# EAGLE design MethaneFlux (EAGLE 9.6.2)
Assembly variants: v1.0

## Sheet 1 of 2: Board 1- Power Module, Arduino MRK NB 1500, Methane Sensors (2600 2602 2611)
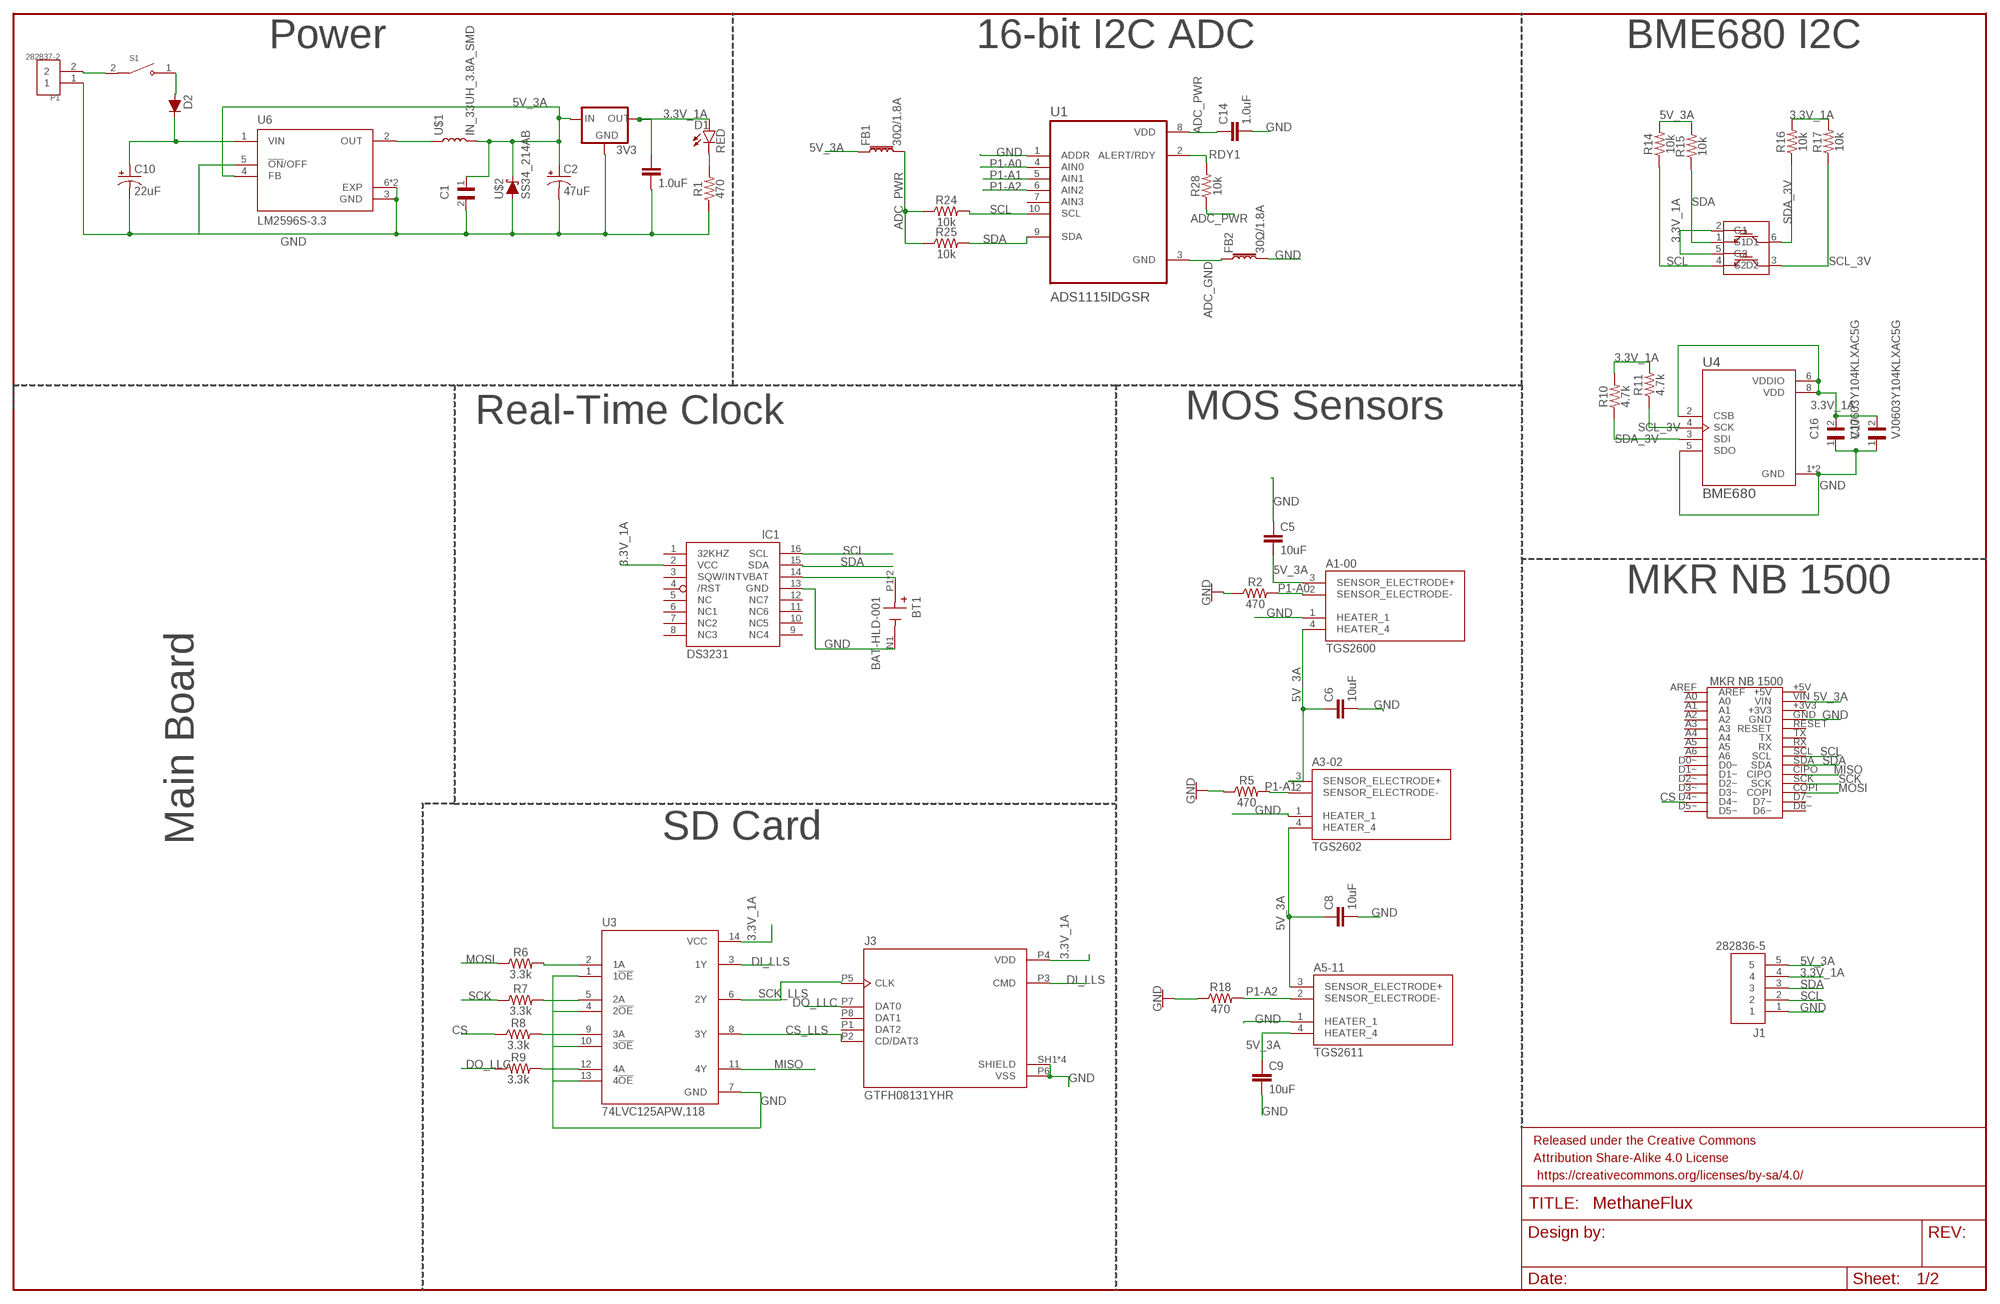
[diagram p0: schematic, sheet 1]

### Parts
3V3  V_REG_LD1117VXXLD1117-SMD  [SOT223]
A1-00  TGS2600  [TO255P920H830-4]
A3-02  TGS2602  [TGS2602]
A5-11  TGS2611  [TGS2611]
BT1  BAT-HLD-001  [BAT_BAT-HLD-001]
C1  T491A107M004AT  [CAPC3216X110N]
C2  47uF  47UF-POLAR-PANASONIC_D-35V-20%  [PANASONIC_D]
C3  1.0uF  1.0UF-0603-16V-10%  [0603]
C5  10uF  10UF-0603-6.3V-20%  [0603]
C6  10uF  10UF-0603-6.3V-20%  [0603]
C8  10uF  10UF-0603-6.3V-20%  [0603]
C9  10uF  10UF-0603-6.3V-20%  [0603]
C10  22uF  22UF-POLAR-PANASONIC_C-35V-20%  [PANASONIC_C]
C14  1.0uF  1.0UF-0603-16V-10%  [0603]
C16  VJ0603Y104KLXAC5G  [CAPC1608X92N]
C17  VJ0603Y104KLXAC5G  [CAPC1608X92N]
D1  RED  LED-RED0603  [LED-0603]
D2  200mA/100V/1V  DIODE-1N4148  [DIODE-1N4148]
FB1  30Ω/1.8A  FERRITE_BEAD-0603  [0603]
FB2  30Ω/1.8A  FERRITE_BEAD-0603  [0603]
FRAME1  FRAME-LEDGER  [CREATIVE_COMMONS]
IC1  DS3231/SO  [SO16W]
J1  282836-5  [TE_282836-5]
J3  GTFH08131YHR  [AMPHENOL_GTFH08131YHR]
P1  282837-2  [TE_282837-2]
R1  470  470OHM-0603-1/10W-1%  [0603]
R2  470  470OHM-0603-1/10W-1%  [0603]
R5  470  470OHM-0603-1/10W-1%  [0603]
R6  3.3k  3.3KOHM-0603-1/10W-1%  [0603]
R7  3.3k  3.3KOHM-0603-1/10W-1%  [0603]
R8  3.3k  3.3KOHM-0603-1/10W-1%  [0603]
R9  3.3k  3.3KOHM-0603-1/10W-1%  [0603]
R10  4.7k  4.7KOHM-0603-1/10W-1%  [0603]
R11  4.7k  4.7KOHM-0603-1/10W-1%  [0603]
R14  10k  10KOHM-0603-1/10W-1%  [0603]
R15  10k  10KOHM-0603-1/10W-1%  [0603]
R16  10k  10KOHM-0603-1/10W-1%  [0603]
R17  10k  10KOHM-0603-1/10W-1%  [0603]
R18  470  470OHM-0603-1/10W-1%  [0603]
R24  10k  10KOHM-0603-1/10W-1%  [0603]
R25  10k  10KOHM-0603-1/10W-1%  [0603]
R28  10k  10KOHM-0603-1/10W-1%  [0603]
S1  RB141C1100  [SW_RB141C1100]
U1  ADS1115IDGSR  [SOP50P490X110-10N]
U3  74LVC125APW,118  [IC_74LVC125APW,118]
U4  BME680  [PSON80P300X300X100-8N]
U6  LM2596S-3.3  [VREG_LM2596S-3.3]
U$1  IN_33UH_3.8A_SMD  [INDUCTOR_4X4MM]
U$2  SS34_214AB  [SOD-323]
U$3  2N7002DW  [SOT363]
U$5  MKRNB1500  [MRKNB1500]

### Nets
3.3V_1A [5$3v3_1A]: 3V3.2(OUT) C3.1 C16.2 C17.2 D1.A IC1.2(VCC) J1.4 J3.P4(VDD) R10.2 R11.2 R16.2 R17.2 U3.14(VCC) U4.2(CSB) U4.6(VDDIO) U4.8(VDD) U$3.2(G1) U$3.5(G2)
5V_3A [5$3v3_1A]: 3V3.3(IN) A1-00.3(SENSOR_ELECTRODE+) A1-00.4(HEATER_4) A3-02.3(SENSOR_ELECTRODE+) A3-02.4(HEATER_4) A5-11.3(SENSOR_ELECTRODE+) A5-11.4(HEATER_4) C1.1 C2.+ C5.2 C6.1 C8.1 C9.1 FB1.1 J1.5 R14.2 R15.2 U6.4(FB) U$1.P$2 U$2.C U$5.VIN
ADC_GND: FB2.1 U1.3(GND)
ADC_PWR: C14.1 FB1.2 R24.1 R25.1 R28.1 U1.8(VDD)
CS [SPI]: R8.1 U$5.D4~
CS_LLS [SPI]: J3.P2(CD/DAT3) U3.8(3Y)
DI_LLS [SPI]: J3.P3(CMD) U3.3(1Y)
DO_LLC [SPI]: J3.P7(DAT0) R9.1
GND [GND]: 3V3.1(GND) A1-00.1(HEATER_1) A3-02.1(HEATER_1) A5-11.1(HEATER_1) BT1.N1(-) C1.2 C2.- C3.2 C5.1 C6.2 C8.2 C9.2 C10.- C14.2 C16.1 C17.1 FB2.2 IC1.13(GND) J1.1 J3.P6(VSS) J3.SH1(SHIELD) J3.SH2(SHIELD) J3.SH3(SHIELD) J3.SH4(SHIELD) P1.1 R1.1 R2.1 R5.1 R18.1 U1.1(ADDR) U3.1(1!OE) U3.4(2!OE) U3.7(GND) U3.10(3!OE) U3.13(4!OE) U4.1(GND) U4.5(SDO) U4.7(GND) U6.3(GND) U6.5(!ON!/OFF) U6.6(EXP) U6.7(EXP) U$2.A U$5.GND
MISO [SPI]: U3.11(4Y) U$5.CIPO
MOSI [SPI]: R6.1 U$5.COPI
N$3 [SPI]: R6.2 U3.2(1A)
N$4: P1.2 S1.2
N$5: D2.A S1.1
N$6 [SPI]: R7.2 U3.5(2A)
N$7 [SPI]: R8.2 U3.9(3A)
N$8 [SPI]: R9.2 U3.12(4A)
N$9: U6.2(OUT) U$1.P$1
N$10: BT1.P1(+) BT1.P2(+) IC1.14(VBAT)
N$13: C10.+ D2.C U6.1(VIN)
N$14: D1.C R1.2
P1-A0 [ADC]: A1-00.2(SENSOR_ELECTRODE-) R2.2 U1.4(AIN0)
P1-A1 [ADC]: A3-02.2(SENSOR_ELECTRODE-) R5.2 U1.5(AIN1)
P1-A2 [ADC]: A5-11.2(SENSOR_ELECTRODE-) R18.2 U1.6(AIN2)
RDY1: R28.2 U1.2(ALERT/RDY)
SCK [SPI]: R7.1 U$5.SCK
SCK_LLS [SPI]: J3.P5(CLK) U3.6(2Y)
SCL: IC1.16(SCL) J1.2 R14.1 R24.2 U1.10(SCL) U$3.4(S2) U$5.SCL
SCL_3V: R11.1 R17.1 U4.4(SCK) U$3.3(D2)
SDA: IC1.15(SDA) J1.3 R15.1 R25.2 U1.9(SDA) U$3.1(S1) U$5.SDA
SDA_3V: R10.1 R16.1 U4.3(SDI) U$3.6(D1)
Unconnected: IC1.1(32KHZ) IC1.3(SQW/INT) IC1.4(/RST) IC1.5(NC) IC1.6(NC1) IC1.7(NC2) IC1.8(NC3) IC1.9(NC4) IC1.10(NC5) IC1.11(NC6) IC1.12(NC7) J3.P1(DAT2) J3.P8(DAT1) U1.7(AIN3) U$5.+3V3 U$5.+5V U$5.A0 U$5.A1 U$5.A2 U$5.A3 U$5.A4 U$5.A5 U$5.A6 U$5.AREF U$5.D0~ U$5.D1~ U$5.D2~ U$5.D3~ U$5.D5~ U$5.D6~ U$5.D7~ U$5.RESET U$5.RX U$5.TX

### Notes on the sheet
- Power | 16-bit I2C ADC | BME680 I2C
- Real-Time Clock | MOS Sensors
- MKR NB 1500
- Main Board | SD Card

## Sheet 2 of 2: Breakoff part to board 1- Methane Sensors (2600 2602 2611) and the ADC & BME
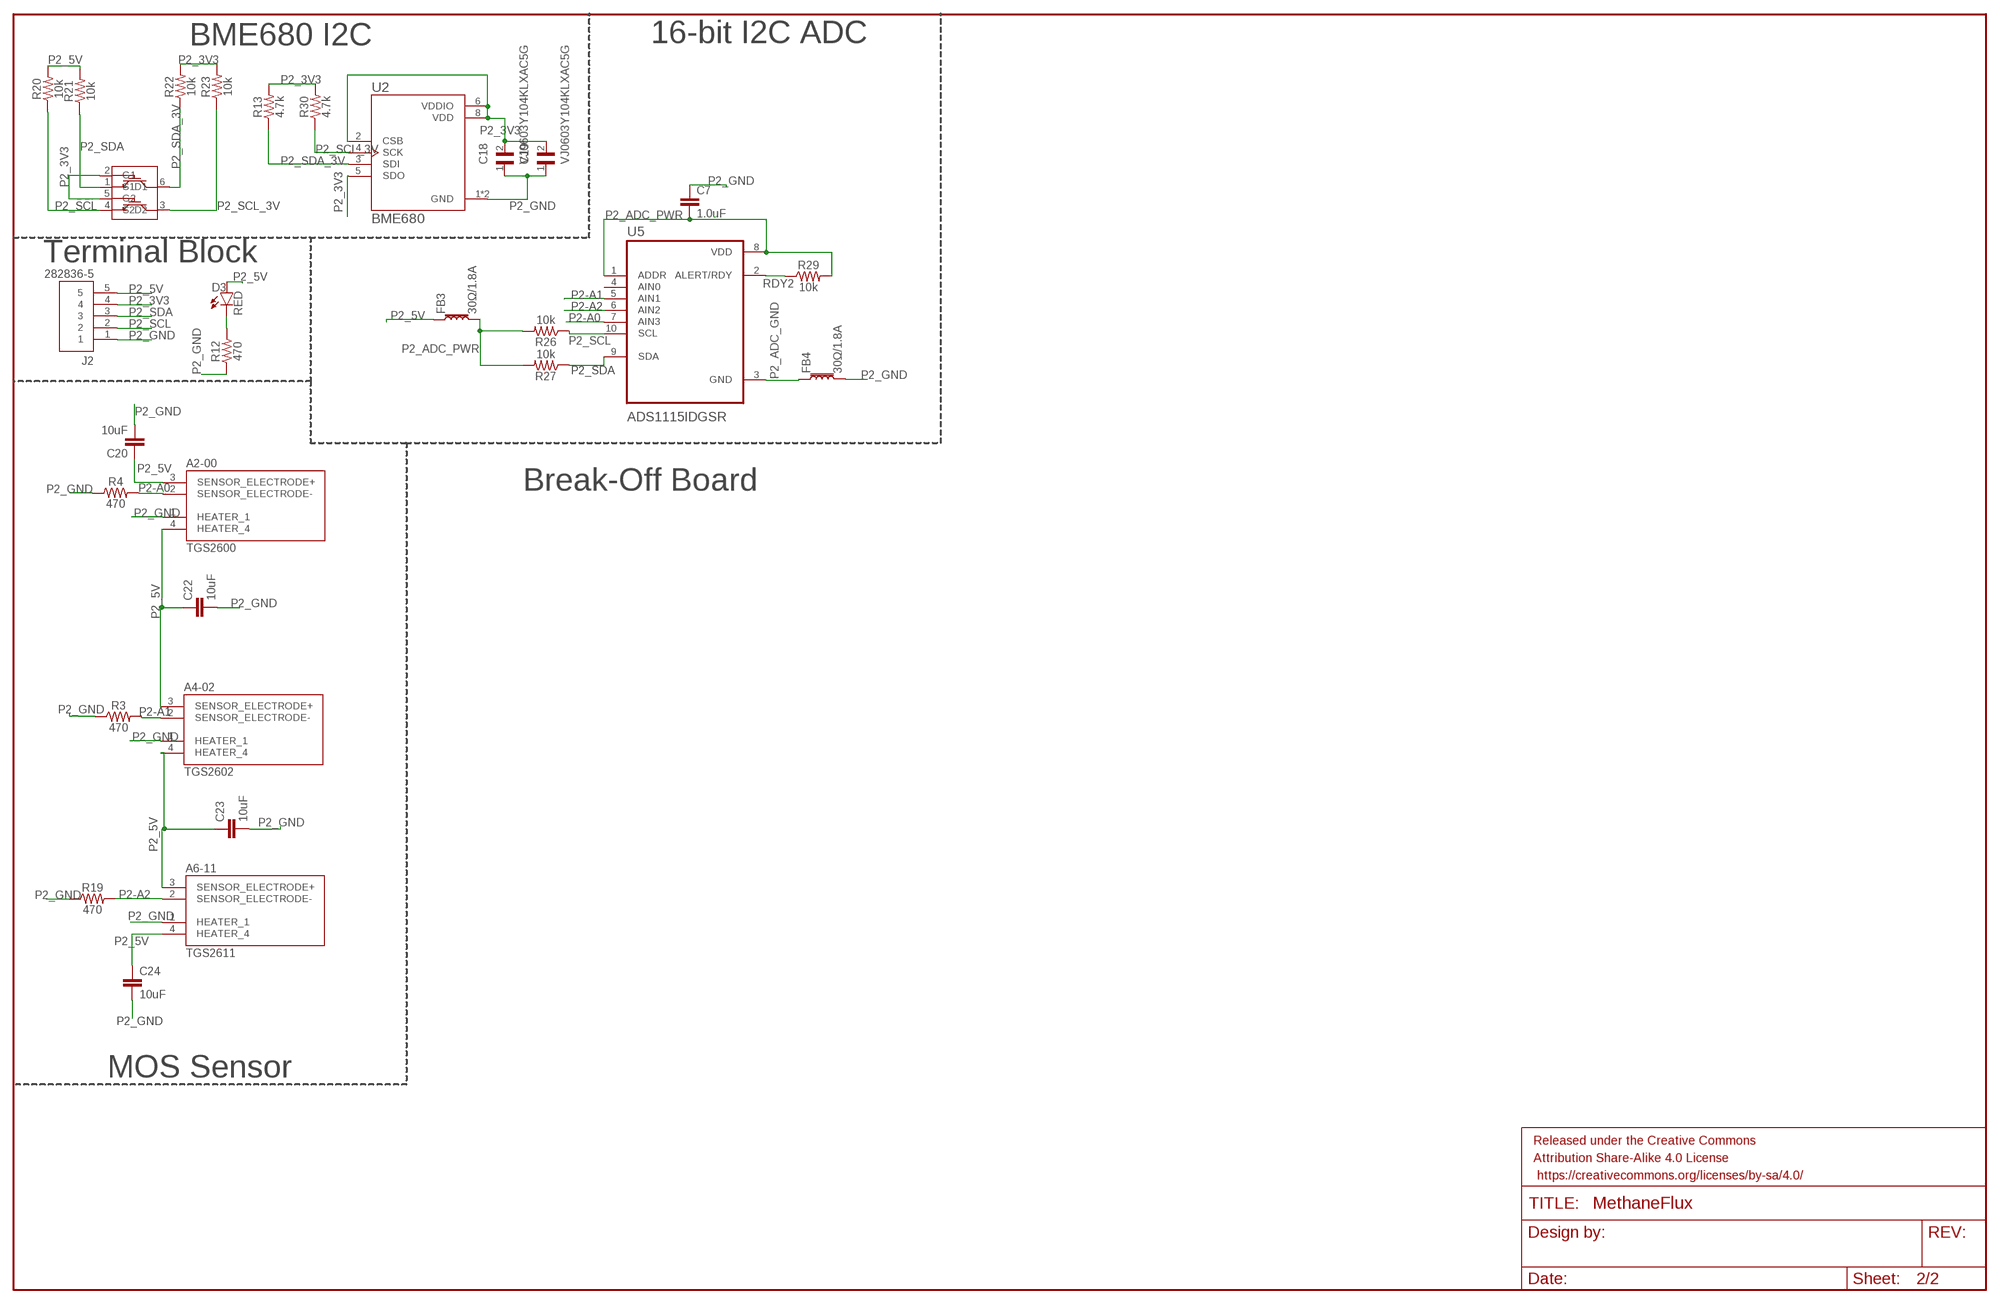
[diagram p1: schematic, sheet 2]

### Parts
A2-00  TGS2600  [TO255P920H830-4]
A4-02  TGS2602  [TGS2602]
A6-11  TGS2611  [TGS2611]
C7  1.0uF  1.0UF-0603-16V-10%  [0603]
C18  VJ0603Y104KLXAC5G  [CAPC1608X92N]
C19  VJ0603Y104KLXAC5G  [CAPC1608X92N]
C20  10uF  10UF-0603-6.3V-20%  [0603]
C22  10uF  10UF-0603-6.3V-20%  [0603]
C23  10uF  10UF-0603-6.3V-20%  [0603]
C24  10uF  10UF-0603-6.3V-20%  [0603]
D3  RED  LED-RED0603  [LED-0603]
FB3  30Ω/1.8A  FERRITE_BEAD-0603  [0603]
FB4  30Ω/1.8A  FERRITE_BEAD-0603  [0603]
FRAME2  FRAME-LEDGER  [CREATIVE_COMMONS]
J2  282836-5  [TE_282836-5]
R3  470  470OHM-0603-1/10W-1%  [0603]
R4  470  470OHM-0603-1/10W-1%  [0603]
R12  470  470OHM-0603-1/10W-1%  [0603]
R13  4.7k  4.7KOHM-0603-1/10W-1%  [0603]
R19  470  470OHM-0603-1/10W-1%  [0603]
R20  10k  10KOHM-0603-1/10W-1%  [0603]
R21  10k  10KOHM-0603-1/10W-1%  [0603]
R22  10k  10KOHM-0603-1/10W-1%  [0603]
R23  10k  10KOHM-0603-1/10W-1%  [0603]
R26  10k  10KOHM-0603-1/10W-1%  [0603]
R27  10k  10KOHM-0603-1/10W-1%  [0603]
R29  10k  10KOHM-0603-1/10W-1%  [0603]
R30  4.7k  4.7KOHM-0603-1/10W-1%  [0603]
U2  BME680  [PSON80P300X300X100-8N]
U5  ADS1115IDGSR  [SOP50P490X110-10N]
U$4  2N7002DW  [SOT363]

### Nets
N$1 [5$3v3_1A]: D3.C R12.2
P2-A0 [ADC]: A2-00.2(SENSOR_ELECTRODE-) R4.2 U5.7(AIN3)
P2-A1 [ADC]: A4-02.2(SENSOR_ELECTRODE-) R3.2 U5.5(AIN1)
P2-A2 [ADC]: A6-11.2(SENSOR_ELECTRODE-) R19.2 U5.6(AIN2)
P2_3V3 [5$3v3_1A]: C18.2 C19.2 J2.4 R13.2 R22.2 R23.2 R30.2 U2.2(CSB) U2.5(SDO) U2.6(VDDIO) U2.8(VDD) U$4.2(G1) U$4.5(G2)
P2_5V [5$3v3_1A]: A2-00.3(SENSOR_ELECTRODE+) A2-00.4(HEATER_4) A4-02.3(SENSOR_ELECTRODE+) A4-02.4(HEATER_4) A6-11.3(SENSOR_ELECTRODE+) A6-11.4(HEATER_4) C20.1 C22.1 C23.1 C24.1 D3.A FB3.1 J2.5 R20.2 R21.2
P2_ADC_GND: FB4.1 U5.3(GND)
P2_ADC_PWR: C7.2 FB3.2 R26.2 R27.2 R29.2 U5.1(ADDR) U5.8(VDD)
P2_GND [P2_GND]: A2-00.1(HEATER_1) A4-02.1(HEATER_1) A6-11.1(HEATER_1) C7.1 C18.1 C19.1 C20.2 C22.2 C23.2 C24.2 FB4.2 J2.1 R3.1 R4.1 R12.1 R19.1 U2.1(GND) U2.7(GND)
P2_SCL: J2.2 R20.1 R26.1 U5.10(SCL) U$4.4(S2)
P2_SCL_3V: R23.1 R30.1 U2.4(SCK) U$4.3(D2)
P2_SDA: J2.3 R21.1 R27.1 U5.9(SDA) U$4.1(S1)
P2_SDA_3V: R13.1 R22.1 U2.3(SDI) U$4.6(D1)
RDY2: R29.1 U5.2(ALERT/RDY)
Unconnected: U5.4(AIN0)

### Notes on the sheet
- BME680 I2C | 16-bit I2C ADC
- Terminal Block
- Break-Off Board
- MOS Sensor

## Library data of the parts
3V3 = SparkFun-IC-Power:V_REG_LD1117VXX: LD1117VXX voltage regulator. We carry the 3.3V version (COM-00526) in TO-220 package.; PROD_ID: VREG-13917
A1-00 A2-00 = TGS2600:TGS2600: Check availability <https://pricing.snapeda.com/parts/TGS2600/Figaro/view-part?ref=eda>; AVAILABILITY: In Stock; CHECK_PRICES: https://www.snapeda.com/parts/TGS2600/Figaro/view-part/?ref=eda; DESCRIPTION: Gas sensor [Figaro] TGS2600 Gas sensor; MF: Figaro; MP: TGS2600; PACKAGE: None; PRICE: None; SNAPEDA_LINK: https://www.snapeda.com/parts/TGS2600/Figaro/view-part/?ref=snap
A3-02 A4-02 = TGS2600:TGS2602
A5-11 A6-11 = TGS2600:TGS2611
BT1 = BAT-HLD-001:BAT-HLD-001: Battery Retainer Coin, 20.0mm 1 Cell SMD (SMT) Tab Check availability <https://pricing.snapeda.com/parts/BAT-HLD-001/Linx%20Technologies/view-part?ref=eda>; AVAILABILITY: In Stock; CHECK_PRICES: https://www.snapeda.com/parts/BAT-HLD-001/Linx+Technologies+Inc./view-part/?ref=eda; DESCRIPTION: Holder for CR2032 and CR2025 Batteries, Surface-Mount, Bulk Packaging; MF: Linx Technologies; MP: BAT-HLD-001; PACKAGE: None; PRICE: None; PURCHASE-URL: https://www.snapeda.com/api/url_track_click_mouser/?unipart_id=184402&manufacturer=Linx Technologies&part_name=BAT-HLD-001&search_term=cr2032 battery holder; SNAPEDA_LINK: https://www.snapeda.com/parts/BAT-HLD-001/Linx+Technologies+Inc./view-part/?ref=snap
C1 = T491A107M004AT:T491A107M004AT: Tantalum Capacitor; Capacitor Type:Solid; Capacitance:100µF; Capacitance Tolerance:± 20%; Voltage Rating:4VDC; Capacitor Dielectric Type:Tantalum; Package/Case:3216-18; Termination Type:SMD; ESR:4ohm; Leaded Process Compatible:Yes ;RoHS Compliant: Yes Check availability <https://pricing.snapeda.com/parts/T491A107M004AT/KEMET/view-part?ref=eda>; AVAILABILITY: In Stock; CHECK_PRICES: https://www.snapeda.com/parts/T491A107M004AT/KEMET/view-part/?ref=eda; DESCRIPTION: Capacitors Tantalum PCB 100uF SMD Tol 20% 4 VDC Case Size 3216 T491 Series | KEMET T491A107M004AT; MF: KEMET; MP: T491A107M004AT; PACKAGE: SMD-2 KEMET; PRICE: None; PURCHASE-URL: https://www.snapeda.com/api/url_track_click_mouser/?unipart_id=577514&manufacturer=KEMET&part_name=T491A107M004AT&search_term=t491a107m004at; SNAPEDA_LINK: https://www.snapeda.com/parts/T491A107M004AT/KEMET/view-part/?ref=snap
C2 = SparkFun-Capacitors:47UF-POLAR: 47µF polarized capacitors A capacitor is a passive two-terminal electrical component used to store electrical energy temporarily in an electric field.; PROD_ID: CAP-08478
C3 C7 C14 = SparkFun-Capacitors:1.0UF: 1µF ceramic capacitors A capacitor is a passive two-terminal electrical component used to store electrical energy temporarily in an electric field.; PROD_ID: CAP-00868
C5 C6 C8 C9 C20 C22-C24 = SparkFun-Capacitors:10UF: 10.0µF ceramic capacitors A capacitor is a passive two-terminal electrical component used to store electrical energy temporarily in an electric field.; PROD_ID: CAP-11015
C10 = SparkFun-Capacitors:22UF-POLAR: 22µF polarized capacitors A capacitor is a passive two-terminal electrical component used to store electrical energy temporarily in an electric field.; PROD_ID: CAP-08618
C16-C19 = VJ0603Y104KLXAC5G:VJ0603Y104KLXAC5G: Multilayer Ceramic Capacitors MLCC - SMD/SMT 100nF 25volts 10% Check availability <https://pricing.snapeda.com/parts/VJ0603Y104KLXAC5G/Vishay/view-part?ref=eda>; AVAILABILITY: In Stock; CHECK_PRICES: https://www.snapeda.com/parts/VJ0603Y104KLXAC5G/Vishay/view-part/?ref=eda; DESCRIPTION: Multilayer Ceramic Capacitors MLCC - SMD/SMT 100nF 25volts 10%; MF: Vishay; MP: VJ0603Y104KLXAC5G; PACKAGE: 0603 Vishay; PRICE: None; SNAPEDA_LINK: https://www.snapeda.com/parts/VJ0603Y104KLXAC5G/Vishay/view-part/?ref=snap
D1 D3 = SparkFun-LED:LED-RED: Red SMD LED Used in manufacturing of most products at SparkFun Packages: 0603 - SMD 0603 package [Product Link] <http://docs.avagotech.com/docs/AV02-0551EN> 0603 SMART - SMD 0603 SMART package ( more efficient and expensive)[Product Link] <http://www.osram-os.com/Graphics/XPic2/00077099_0.pdf> 1206 - SMD1206 package [Product Link] <https://www.sparkfun.com/datasheets/DevTools/LilyPad/Q150OVS4.pdff> SparkFun Products: Pro Mini 328 -5V <https://www.sparkfun.com/products/821> RedBoard <https://www.sparkfun.com/products/12757> IOIO-OTG <https://www.sparkfun.com/products/13613>; PROD_ID: DIO-00819
D2 = SparkFun-DiscreteSemi:DIODE: Diode These are standard reverse protection diodes and small signal diodes. SparkFun Products: SparkFun SparkPunk Sound Kit <https://www.sparkfun.com/products/11177> SparkFun ESP8266 Thing <https://www.sparkfun.com/products/13231>; PROD_ID: DIO-08378
FB1-FB4 = SparkFun-Coils:FERRITE_BEAD: Ferrite Bead (blocks, cores, rings, chokes, etc.) Inductor with layers of ferrite used to suppress high frequencies. Often used to isolate high frequency noise. SparkFun Products: IOIO-OTG - V2.2 <https://www.sparkfun.com/products/13613> SparkFun SAMD21 Mini Breakout <https://www.sparkfun.com/products/13664> SparkFun 6 Degrees of Freedom Breakout - LSM6DS3 <https://www.sparkfun.com/products/13339> SparkFun SAMD21 Dev Breakout <https://www.sparkfun.com/products/13672>; PROD_ID: NDUC-13805
FRAME1 FRAME2 = SparkFun-Aesthetics:FRAME-LEDGER: Schematic Frame - Ledger Standard 11x14 US Ledger frame
IC1 = DS3231:DS3231: Check availability <https://pricing.snapeda.com/parts/DS3231/Analog%20Devices/view-part?ref=eda>; AVAILABILITY: In Stock; CHECK_PRICES: https://www.snapeda.com/parts/DS3231/Analog+Devices/view-part/?ref=eda; DESCRIPTION: Real Time Clock (RTC) IC Clock/Calendar - I²C, 2-Wire Serial 8-SOIC (0.154, 3.90mm Width); MF: Analog Devices; MP: DS3231; PACKAGE: SOIC-16 Maxim Integrated; PRICE: None; PURCHASE-URL: https://www.snapeda.com/api/url_track_click_mouser/?unipart_id=553791&manufacturer=Analog Devices&part_name=DS3231&search_term=ds3231; SNAPEDA_LINK: https://www.snapeda.com/parts/DS3231/Analog+Devices/view-part/?ref=snap
J1 J2 = 282836-5:282836-5: Check availability <https://pricing.snapeda.com/parts/282836-5/TE%20Connectivity/view-part?ref=eda>; AVAILABILITY: In Stock; CHECK_PRICES: https://www.snapeda.com/parts/282836-5/TE+Connectivity+AMP+Connectors/view-part/?ref=eda; COMMENT: 282836-5; DESCRIPTION: 5 Position Wire to Board Terminal Block Horizontal with Board 0.197 (5.00mm) Through Hole; EU_ROHS_COMPLIANCE: Compliant with Exemptions; MF: TE Connectivity; MP: 282836-5; PACKAGE: None; PRICE: None; PURCHASE-URL: https://www.snapeda.com/api/url_track_click_mouser/?unipart_id=417471&manufacturer=TE Connectivity&part_name=282836-5&search_term=282836-5; SNAPEDA_LINK: https://www.snapeda.com/parts/282836-5/TE+Connectivity+AMP+Connectors/view-part/?ref=snap
J3 = GTFH08131YHR:GTFH08131YHR: Check availability <https://pricing.snapeda.com/parts/GTFH08131YHR/Amphenol%20ICC/view-part?ref=eda>; AVAILABILITY: In Stock; CHECK_PRICES: https://www.snapeda.com/parts/GTFH08131YHR/Amphenol+FCI/view-part/?ref=eda; DESCRIPTION: Micro SD and SD Card Sockets, Input Output Connectors, Micro SD Socket, 8 Position, Hinge Type Right Angle SMT, LCP Black; MF: Amphenol ICC; MP: GTFH08131YHR; PACKAGE: None; PRICE: None; PURCHASE-URL: https://www.snapeda.com/api/url_track_click_mouser/?unipart_id=3603870&manufacturer=Amphenol ICC&part_name=GTFH08131YHR&search_term=micro sd socket; SNAPEDA_LINK: https://www.snapeda.com/parts/GTFH08131YHR/Amphenol+FCI/view-part/?ref=snap
P1 = 282837-2:282837-2: TERM BLOCK 5.08MM 2POS SIDE ENTY Check availability <https://pricing.snapeda.com/parts/282837-2/TE%20Connectivity/view-part?ref=eda>; AVAILABILITY: In Stock; CHECK_PRICES: https://www.snapeda.com/parts/282837-2/TE+Connectivity+AMP+Connectors/view-part/?ref=eda; COMMENT: 282837-2; DESCRIPTION: Terminal Block Connector Wire Receptacle 2 5.08 mm 30-16 AWG Green 13.5 A 250 V | TE Connectivity 282837-2; MF: TE Connectivity; MP: 282837-2; PACKAGE: None; PRICE: None; PURCHASE-URL: https://www.snapeda.com/api/url_track_click_mouser/?unipart_id=2549980&manufacturer=TE Connectivity&part_name=282837-2&search_term=None; SNAPEDA_LINK: https://www.snapeda.com/parts/282837-2/TE+Connectivity+AMP+Connectors/view-part/?ref=snap
R1-R5 R12 R18 R19 = SparkFun-Resistors:470OHM: 470Ω resistor A resistor is a passive two-terminal electrical component that implements electrical resistance as a circuit element. Resistors act to reduce current flow, and, at the same time, act to lower voltage levels within circuits. - Wikipedia; PROD_ID: RES-07869
R6-R9 = SparkFun-Resistors:3.3KOHM: 3.3kΩ resistor A resistor is a passive two-terminal electrical component that implements electrical resistance as a circuit element. Resistors act to reduce current flow, and, at the same time, act to lower voltage levels within circuits. - Wikipedia; PROD_ID: RES-07851
R10 R11 R13 R30 = SparkFun-Resistors:4.7KOHM: 4.7kΩ resistor A resistor is a passive two-terminal electrical component that implements electrical resistance as a circuit element. Resistors act to reduce current flow, and, at the same time, act to lower voltage levels within circuits. - Wikipedia; PROD_ID: RES-07857
R14-R17 R20-R29 = SparkFun-Resistors:10KOHM: 10kΩ resistor A resistor is a passive two-terminal electrical component that implements electrical resistance as a circuit element. Resistors act to reduce current flow, and, at the same time, act to lower voltage levels within circuits. - Wikipedia; PROD_ID: RES-00824
S1 = RB141C1100:RB141C1100: Swicth SPST RB141C1100 Check availability <https://pricing.snapeda.com/parts/RB141C1100/E-Switch/view-part?ref=eda>; AVAILABILITY: In Stock; CHECK_PRICES: https://www.snapeda.com/parts/RB141C1100/E-Switch/view-part/?ref=eda; DESCRIPTION: Rocker Switch, RB1 Series, SPST, ON-OFF, Non-Illum, Black, 15A, 125VAC, QC | E-Switch RB141C1100; MF: E-Switch; MP: RB141C1100; PACKAGE: None; PRICE: None; PURCHASE-URL: https://www.snapeda.com/api/url_track_click_mouser/?unipart_id=4449618&manufacturer=E-Switch&part_name=RB141C1100&search_term=rs-001g-a-bb-4; SNAPEDA_LINK: https://www.snapeda.com/parts/RB141C1100/E-Switch/view-part/?ref=snap
U1 U5 = ADS1115IDGSR:ADS1115IDGSR: Check availability <https://pricing.snapeda.com/parts/ADS1115IDGSR/Texas%20Instruments/view-part?ref=eda>; AVAILABILITY: In Stock; CHECK_PRICES: https://www.snapeda.com/parts/ADS1115IDGSR/Texas+Instruments/view-part/?ref=eda; DESCRIPTION: 16-bit, 860-SPS, 4-channel, delta-sigma ADC with PGA, oscillator, VREF, comparator and I2C; MF: Texas Instruments; MP: ADS1115IDGSR; PACKAGE: VSSOP-10 Texas Instruments; PRICE: None; PURCHASE-URL: https://www.snapeda.com/api/url_track_click_mouser/?unipart_id=45903&manufacturer=Texas Instruments&part_name=ADS1115IDGSR&search_term=ads1115idgsr; SNAPEDA_LINK: https://www.snapeda.com/parts/ADS1115IDGSR/Texas+Instruments/view-part/?ref=snap
U2 U4 = BME680:BME680: Integrated Environmental Unit Check availability <https://pricing.snapeda.com/parts/BME680/Bosch%20Sensortec/view-part?ref=eda>; AVAILABILITY: In Stock; CHECK_PRICES: https://www.snapeda.com/parts/BME680/Bosch+Sensortec/view-part/?ref=eda; DESCRIPTION: Gas, Humidity, Pressure, Temperature Sensor I²C, SPI Output; MF: Bosch Sensortec; MP: BME680; PACKAGE: LGA-8 Bosch Tools; PRICE: None; PURCHASE-URL: https://www.snapeda.com/api/url_track_click_mouser/?unipart_id=947201&manufacturer=Bosch Sensortec&part_name=BME680&search_term=bme680; SNAPEDA_LINK: https://www.snapeda.com/parts/BME680/Bosch+Sensortec/view-part/?ref=snap
U3 = 74LVC125APW_118:74LVC125APW,118: Check availability <https://pricing.snapeda.com/parts/74LVC125APW%2C118/Nexperia%20USA%20Inc./view-part?ref=eda> Check availability <https://pricing.snapeda.com/parts/74LVC125APW%2C118/Nexperia%20USA%20Inc./view-part?ref=eda> Check availability <https://pricing.snapeda.com/parts/74LVC125APW%2C118/Nexperia%20USA%20Inc./view-part?ref=eda>; AVAILABILITY: In Stock; CHECK_PRICES: https://www.snapeda.com/parts/74LVC125APW,118/Nexperia/view-part/?ref=eda; DESCRIPTION: Buffer, Non-Inverting 4 Element 1 Bit per Element 3-State Output 14-TSSOP; MF: Nexperia USA Inc.; MP: 74LVC125APW,118; PACKAGE: TSSOP14-14 Nexperia USA Inc.; PRICE: None; PURCHASE-URL: https://www.snapeda.com/api/url_track_click_mouser/?unipart_id=5248541&manufacturer=Nexperia USA Inc.&part_name=74LVC125APW,118&search_term=74lvc125apw; SNAPEDA_LINK: https://www.snapeda.com/parts/74LVC125APW,118/Nexperia/view-part/?ref=snap
U6 = LM2596S-3.3:LM2596S-3.3: Conv DC-DC 4.5V to 40V Inv/Step Down Single-Out 3.3V 3A 6-Pin(5+Tab) TO-263 Tube Check availability <https://pricing.snapeda.com/parts/LM2596S-3.3/Texas%20Instruments/view-part?ref=eda>; AVAILABILITY: In Stock; DESCRIPTION: SIMPLE SWITCHER&reg; 4.5V to 40V, 3A Low Component Count Step-Down Regulator 5-DDPAK/TO-263; MF: Texas Instruments; MP: LM2596S-3.3; PACKAGE: TO-263-5 Texas Instruments; PRICE: None; PURCHASE-URL: https://pricing.snapeda.com/search/part/LM2596S-3.3/?ref=eda
U$1 = SV_Inductors:IN_33UH_3.8A_SMD
U$2 = SV_Diode:SS34_214AB
U$3 U$4 = 2N7002DW:2N7002DW: Check availability <https://pricing.snapeda.com/parts/2N7002DW/onsemi/view-part?ref=eda>; AVAILABILITY: In Stock; CHECK_PRICES: https://www.snapeda.com/parts/2N7002DW/Onsemi/view-part/?ref=eda; DESCRIPTION: Mosfet Array 60V 115mA 200mW Surface Mount SC-88 (SC-70-6); MF: onsemi; MP: 2N7002DW; PACKAGE: SC-88-6 ON Semiconductor; PRICE: None; PURCHASE-URL: https://www.snapeda.com/api/url_track_click_mouser/?unipart_id=7265289&manufacturer=onsemi&part_name=2N7002DW&search_term=2n7002dw; SNAPEDA_LINK: https://www.snapeda.com/parts/2N7002DW/Onsemi/view-part/?ref=snap
U$5 = MKRNB1500:MKRNB1500: Double check before printing that this layout is right.

## Net classes
0 I2C: width 0.229 mm, clearance 0.003 mm
1 ADC: width 0.305 mm, clearance 0.1 mm
2 PowerIn: width 0.508 mm, clearance 0.003 mm
3 5$3v3_1A: width 0.076 mm, clearance 0.003 mm
5 GND: width 0.025 mm, clearance 0.003 mm
6 P2_GND: width 0.025 mm, clearance 0.003 mm

## Board
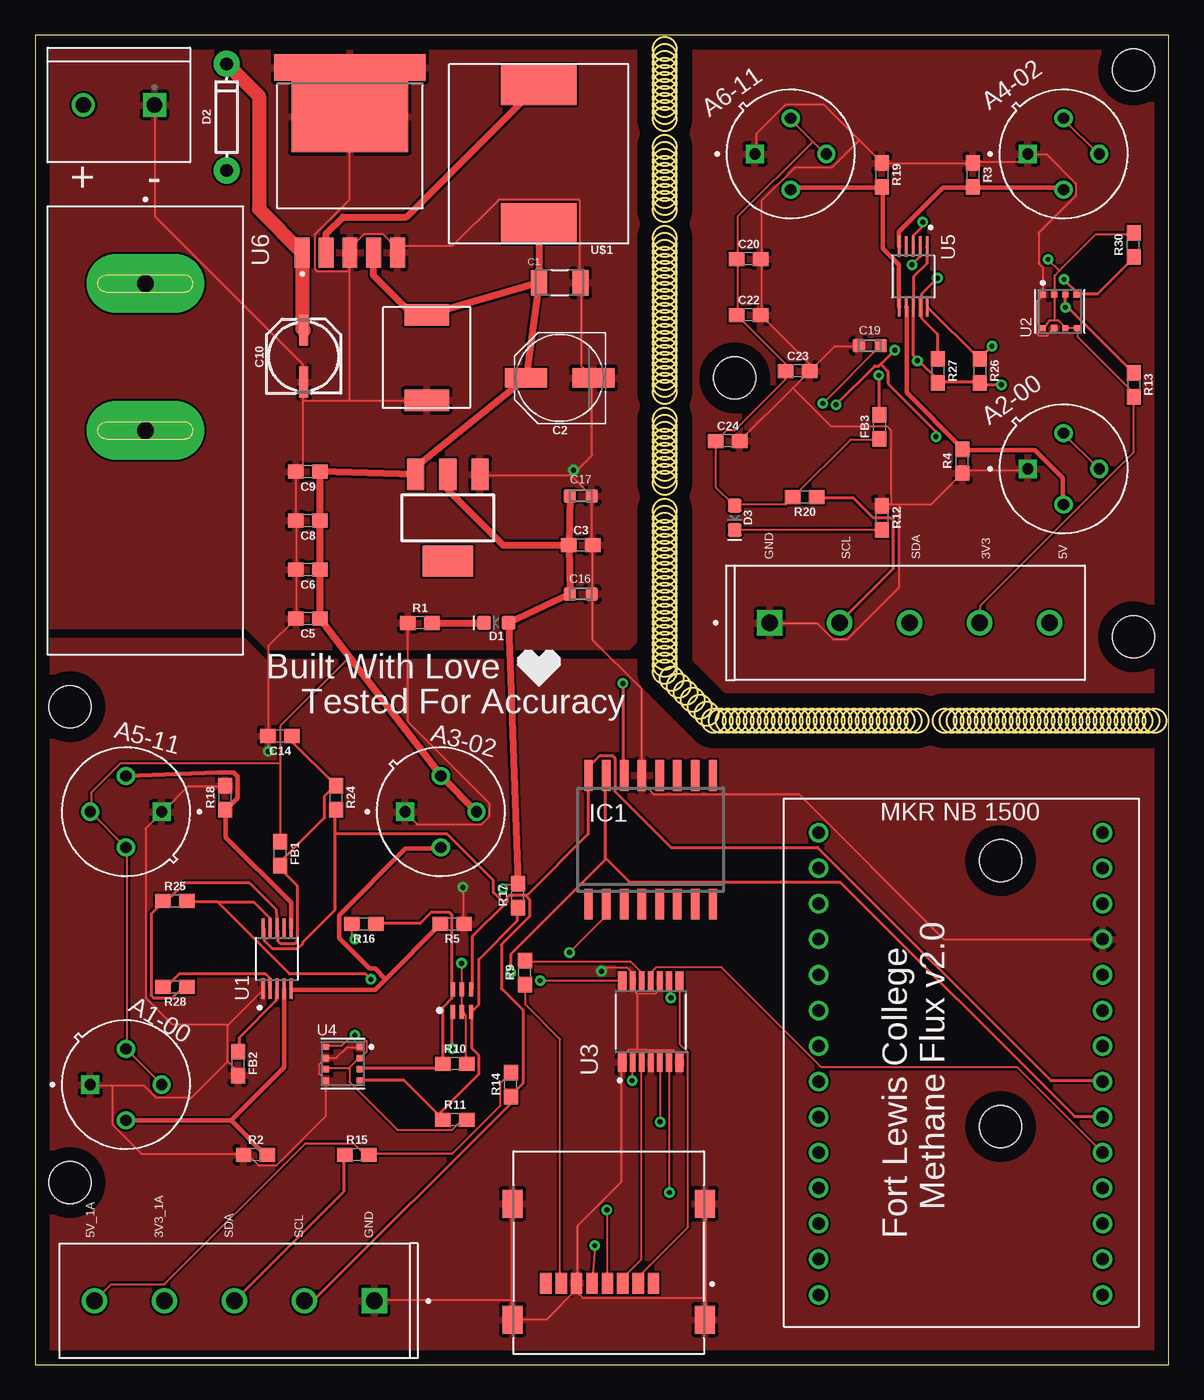
[diagram p2: board, top side]
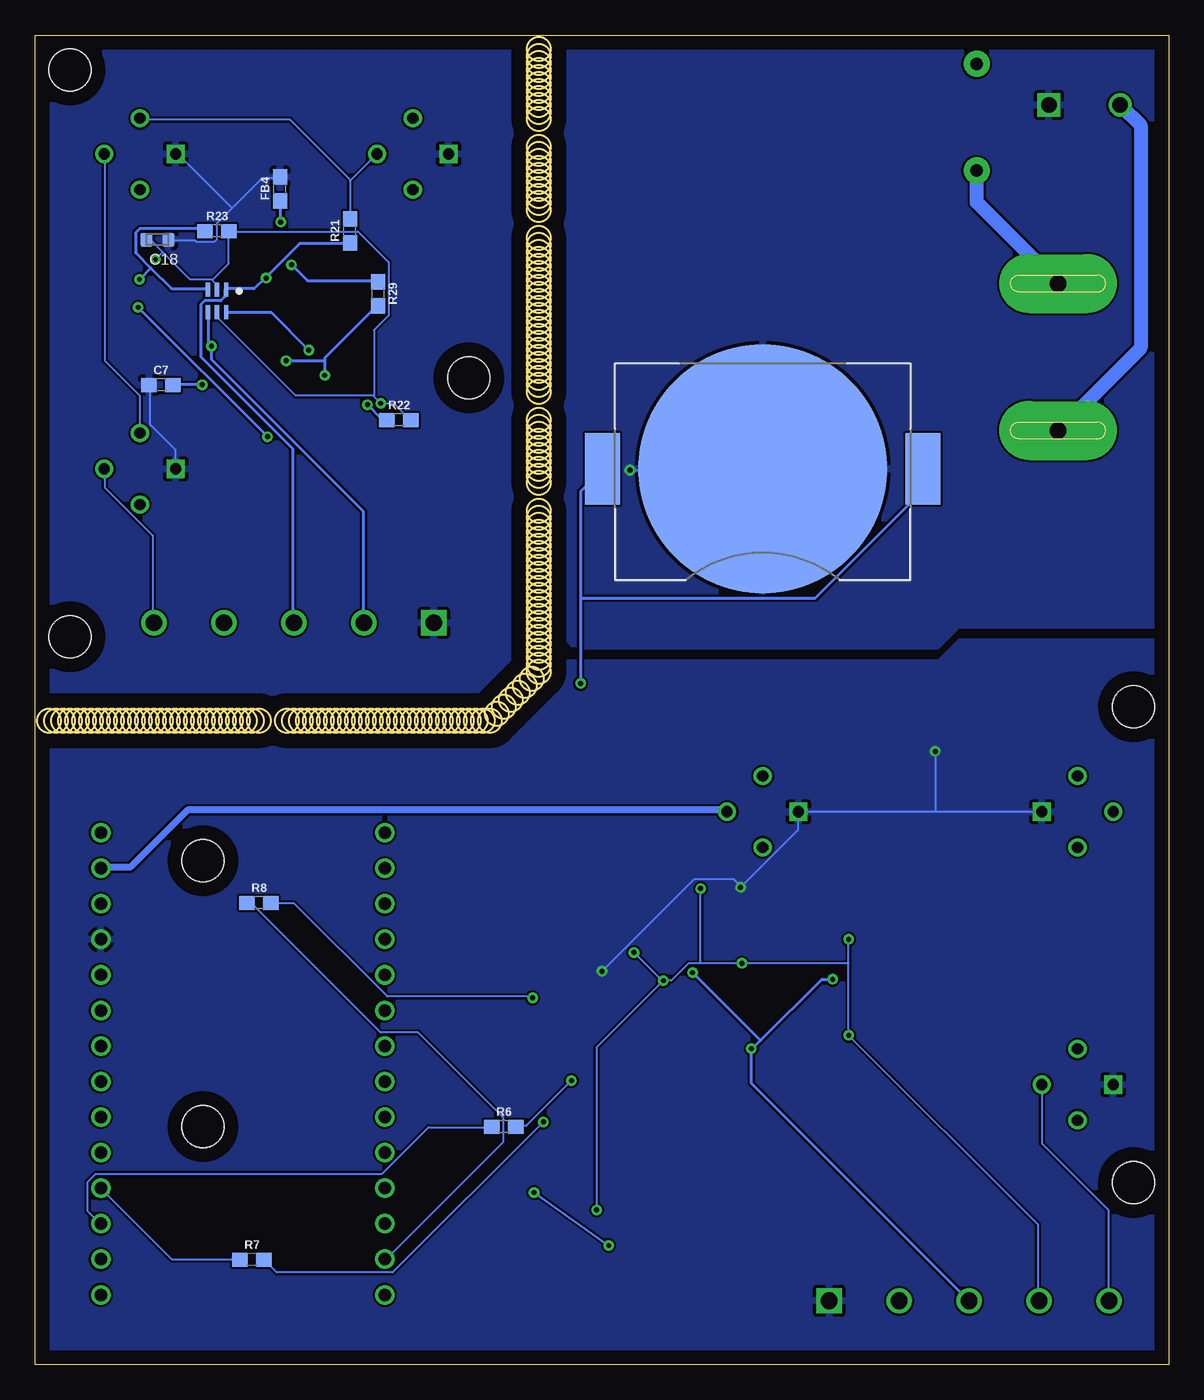
[diagram p3: board, bottom side, seen from below]

Size 81 x 95 mm. Coordinates in mm from the lower left corner, seen from the top.
Outline: 0,0 81,0 81,95 0,95 0,0
Outline: circle at 45,93.5 radius 0.85
Outline: circle at 45,93 radius 0.85
Outline: circle at 45,92.5 radius 0.85
Outline: circle at 45,92 radius 0.85
Outline: circle at 45,91.5 radius 0.85
Outline: circle at 45,91 radius 0.85
Outline: circle at 45,90.5 radius 0.85
Outline: circle at 45,90 radius 0.85
Outline: circle at 45,89.5 radius 0.85
Outline: circle at 45,87 radius 0.85
Outline: circle at 45,86.5 radius 0.85
Outline: circle at 45,86 radius 0.85
Outline: circle at 45,85.5 radius 0.85
Outline: circle at 45,85 radius 0.85
Outline: circle at 45,84.5 radius 0.85
Outline: circle at 45,84 radius 0.85
Outline: circle at 45,83.5 radius 0.85
Outline: circle at 45,83 radius 0.85
Outline: circle at 45,80.5 radius 0.85
Outline: circle at 45,80 radius 0.85
Copper layers (1*16): Top 0.035mm / dielectric 1.5mm / Bottom 0.035mm
Design rules "default *": minimum track width 6mil, minimum drill 0.35mm, track to track 6mil, track to pad 6mil, pad to pad 6mil, via to via 6mil, smd to smd 6mil, copper to edge 40mil, drill to drill 6mil, minimum pad ring 10mil, minimum via ring 8mil, stop-mask expansion 4mil, vias tented up to drill 0mil, thermal gap 10mil
Holes 3 mm at 78.5,52 50,70.5 78.5,92.5 2.5,13 2.5,47 69,36 69,17

### Footprints (pad centres in the part's own frame; a part is rotated, then mirrored left to right if it is on the bottom)
SOT223 = smd 1.219 x 2.235: 1 -2.311,-3.099; 2 0,-3.099; 3 2.311,-3.099 | smd 3.6 x 2.2: 4 0,3.099
TO255P920H830-4 = drill 0.8 square: 1 -2.55,0 | drill 0.8: 2 0,-2.55; 3 2.55,0; 4 0,2.55
TGS2602 = drill 0.8 square: 1 -2.55,0 | drill 0.8: 2 0,-2.55; 3 2.55,0; 4 0,2.55
TGS2611 = drill 0.8 square: 1 -2.55,0 | drill 0.8: 2 0,-2.55; 3 2.55,0; 4 0,2.55
BAT_BAT-HLD-001 = smd 17.8 x 17.8: N1 0,0 | smd 2.5 x 5.1: P1 -11.45,0; P2 11.45,0
CAPC3216X110N = smd 1.16 x 1.82: 1 -1.475,0; 2 1.475,0
PANASONIC_D = smd 3 x 1.4: + 2.4,0; - -2.4,0
0603 = smd 1.1 x 1: 1 -0.85,0; 2 0.85,0
PANASONIC_C = smd 2.2 x 0.65: + 1.9,-0.2; - -1.8,-0.2
CAPC1608X92N = smd 0.92 x 0.97: 1 -0.775,0; 2 0.775,0
LED-0603 = smd 1 x 1: A -0.877,0; C 0.877,0
DIODE-1N4148 = drill 0.9 pad 1.88: A -3.81,0; C 3.81,0
SO16W = smd 0.6 x 2.2: 1 -4.445,-4.6; 2 -3.175,-4.6; 3 -1.905,-4.6; 4 -0.635,-4.6; 5 0.635,-4.6; 6 1.905,-4.6; 7 3.175,-4.6; 8 4.445,-4.6; 9 4.445,4.6; 10 3.175,4.6; 11 1.905,4.6; 12 0.635,4.6; 13 -0.635,4.6; 14 -1.905,4.6; 15 -3.175,4.6; 16 -4.445,4.6
TE_282836-5 = drill 1.2 square: 1 -10,0 | drill 1.2: 2 -5,0; 3 0,0; 4 5,0; 5 10,0
AMPHENOL_GTFH08131YHR = smd 0.8 x 1.5: P1 3.2,-2.2; P2 2.1,-2.2; P3 1,-2.2; P4 -0.1,-2.2; P5 -1.2,-2.2; P6 -2.3,-2.2; P7 -3.4,-2.2; P8 -4.5,-2.2 | smd 1.45 x 2: SH1 -6.875,-4.8; SH2 6.875,-4.8; SH3 6.875,3.5; SH4 -6.875,3.5
TE_282837-2 = drill 1.1 square: 1 -2.54,0 | drill 1.1: 2 2.54,0
SW_RB141C1100 = drill 1.2 pad 4.2 long: 1 10.5,0; 2 0,0
SOP50P490X110-10N = smd 1.47 x 0.28: 1 -2.15,1; 2 -2.15,0.5; 3 -2.15,0; 4 -2.15,-0.5; 5 -2.15,-1; 6 2.15,-1; 7 2.15,-0.5; 8 2.15,0; 9 2.15,0.5; 10 2.15,1
PSON80P300X300X100-8N = smd 0.5 x 0.5: 1 1.2,1.2; 2 1.2,0.4; 3 1.2,-0.4; 4 1.2,-1.2; 5 -1.2,-1.22; 6 -1.2,-0.4; 7 -1.2,0.4; 8 -1.2,1.2
IC_74LVC125APW,118 = smd 1.35 x 0.6: 1 -2.925,2.05; 7 -2.925,-2.05; 8 2.925,-2.05; 14 2.925,2.05 | smd 1.35 x 0.4: 2 -2.925,1.3; 3 -2.925,0.65; 4 -2.925,0; 5 -2.925,-0.65; 6 -2.925,-1.3; 9 2.925,-1.3; 10 2.925,-0.65; 11 2.925,0; 12 2.925,0.65; 13 2.925,1.3
VREG_LM2596S-3.3 = smd 2.16 x 1.07: 1 -6.545,3.4; 2 -6.545,1.7; 3 -6.545,0; 4 -6.545,-1.7; 5 -6.545,-3.4 | smd 5.08 x 8.33: 6 3.175,0 | smd 1.91 x 10.8: 7 6.67,0
INDUCTOR_4X4MM = smd 5.4 x 2.9: P$1 0,-4.95; P$2 0,4.95
SOD-323 = smd 1.52 x 3.2: A 6.1,0; C 0,0
SOT363 = smd 0.3 x 0.99: 1 -0.65,-0.8; 2 0,-0.8; 3 0.65,-0.8; 4 0.65,0.81; 5 0,0.81; 6 -0.65,0.81
MRKNB1500 = drill 0.889: +3V3 5.08,20.3; +5V 0,20.3; A0 2.54,0; A1 5.08,0; A2 7.62,0; A3 10.16,0; A4 12.7,0; A5 15.24,0; A6 17.78,0; AREF 0,0; CIPO 22.86,20.3; COPI 27.94,20.3; D0~ 20.32,0; D1~ 22.86,0; D2~ 25.4,0; D3~ 27.94,0; D4~ 30.48,0; D5~ 33.02,0; D6~ 33.02,20.3; D7~ 30.48,20.3; GND 7.62,20.3; RESET 10.16,20.3; RX 15.24,20.3; SCK 25.4,20.3; SCL 17.78,20.3; SDA 20.32,20.3; TX 12.7,20.3; VIN 2.54,20.3

### Placement (x,y rotation side)
3V3  29.5,60.5 180 top
A1-00  6.5,20 0 top
A2-00  73.5,64 0 top
A3-02  29,39.5 0 top
A4-02  73.5,86.5 0 top
A5-11  6.5,39.5 180 top
A6-11  54,86.5 0 top
BT1  29,64 0 bottom
C1  37.5,77.3 0 top
C2  37.5,70.5 180 top
C3  39,58.55 0 top
C5  19.5,53.3 0 top
C6  19.5,56.8 180 top
C7  72,70 0 bottom
C8  19.5,60.3 180 top
C9  19.5,63.8 180 top
C10  19,72 90 top
C14  17.5,44.92 180 top
C16  39,55.05 180 top
C17  39,62.05 180 top
C18  72.25,80.37 180 bottom
C19  59.65,72.8 0 top
C20  51,79 0 top
C22  51,75 0 top
C23  54.5,71 0 top
C24  49.5,66 0 top
D1  32.96,53 180 top
D2  13.7,89.13 90 top
D3  50,60.5 270 top
FB1  17.5,36.5 270 top
FB2  14.5,21.5 270 top
FB3  60.35,67 90 top
FB4  63.5,84 90 bottom
FRAME1  -77.51,34.96 0 top  (outside the outline)
FRAME2  -76.51,59.85 0 top  (outside the outline)
IC1  44,37.5 0 top
J1  14.25,4.55 180 top
J2  62.5,53 0 top
J3  41,8 0 top
P1  6,90 180 top
R1  27.5,53 0 top
R2  15.76,15 0 top
R3  67,85 270 top
R4  66.25,64.55 90 top
R5  29.81,31.5 180 top
R6  47.5,17 0 bottom
R7  65.5,7.5 0 bottom
R8  65,33 0 bottom
R9  35,28 90 top
R10  30,21.5 0 top
R11  30,17.5 0 top
R12  60.5,60.5 270 top
R13  78.5,70 270 top
R14  34,20 90 top
R15  23,15 0 top
R16  23.5,31.5 180 top
R17  34.5,33.5 90 top
R18  13.59,40.5 270 top
R19  60.5,85 270 top
R20  55,62 180 top
R21  58.5,81 90 bottom
R22  55,67.5 0 bottom
R23  68,81 0 bottom
R24  21.5,40.5 270 top
R25  10,33.12 0 top
R26  67.5,71 270 top
R27  64.5,71 270 top
R28  10,27 180 top
R29  56.5,76.5 270 bottom
R30  78.5,80 90 top
S1  7.89,66.74 90 top
U1  17.3,29 90 top
U2  73.22,75.25 90 top
U3  44,24.5 90 top
U4  22,21.5 0 top
U5  62.75,77.75 270 top
U6  22.5,86 90 top
U$1  36,86.5 180 top
U$2  28,75 270 top
U$3  30.5,26 0 top
U$4  68,76 180 bottom
U$5  56,38 270 top

### Tracks (layer width: path | path; a pad name or v marks a point on that pad's centre or on a via)
3.3V_1A  (via drill 0.35)
  Top 0.152: R10.2 30.77,21.53 30.77,24.96 30.57,25.15 U$3.2 30.48,25.24 30.48,26.77 U$3.5 30.48,26.86 v30.48,28.67 | 22.43,21.19 23.15,21.91 U4.2 23.24,21.91 23.72,22.38 23.72,23.05 23.53,23.24 22.86,23.24 | 22.43,21.19 22.38,21.14 20.86,21.14 U4.6 | 22.86,23.24 22.38,23.24 21.91,22.77 20.86,22.77 U4.8 | R11.2 30.77,17.43 30.48,17.43 29.81,16.76 25.91,16.76 22.48,20.19 22.48,21.14 22.43,21.19 | v22.86,30.39 22.67,30.57 22.67,31.43 R16.2 | 22.86,23.24 v22.86,23.53 | v36.1,27.43 41.91,27.43 U3.14 | v40.86,11.05 40.86,5.81 J3.P4 | v38.2,29.43 40.77,32 40.77,32.86 IC1.2 | v33.43,34 33.72,34.29 34.29,34.29 R17.2
  Top 0.508: C17.2 C3.1 | C3.1 C16.2 D1.A R17.2 | 3V3.2 29.5,62.5 33.45,58.55 C3.1
  Bottom 0.152: 22.86,28.67 v22.86,23.53 9.34,10 9.34,4.57 J1.4 | 22.86,28.67 v22.86,30.39 | v36.1,27.43 35.53,27.43 34.29,28.67 33.43,28.67 | 22.86,28.67 v30.48,28.67 33.43,28.67 | v40.86,11.05 40.86,22.67 v36.1,27.43 | v38.2,29.43 36.2,27.43 v36.1,27.43 | 33.43,28.67 v33.43,34
5V_3A
  Top 0.152: R14.2 33.91,20.77 33.24,20.1 33.24,18.48 29.81,15.05 23.91,15.05 R15.2 23.81,15.05 23.53,15.05 22.77,15.81 19.34,15.81 9.24,5.71 5.43,5.71 4.29,4.57 J1.5 | A1-00.3 6.57,22.48 A1-00.4 6.57,22.57 6.57,36.86 A5-11.4 6.48,36.96 4,39.43 A5-11.3 4,39.53 4,40.86 6.1,42.96 17.53,42.96 | 17.53,42.96 17.53,45.62 22.29,50.39 22.48,50.53 | 17.53,42.96 17.53,37.43 FB1.1
  Top 0.508: U$1.P$2 36.02,81.53 C1.1 | C1.1 U$2.C 27,75 24.2,77.8 U6.4 | C1.1 C2.+ 27,64 3V3.3 C9.1 C8.1 C6.1 C5.2 22.48,50.53 A3-02.4 A3-02.3
  Bottom 0.152: J1.5 4.29,4.57 4.29,11.05 9.05,15.81 9.05,19.91 A1-00.3 | 31.72,39.62 31.62,39.53 A3-02.3 | 76.3,35.53 U$5.VIN
  Bottom 0.508: 76.3,35.53 74.2,35.53 70.1,39.62 31.72,39.62
ADC_GND
  Top 0.229: FB2.1 14.57,22.38 14.57,23.34 17.24,26 17.24,26.77 U1.3
ADC_PWR
  Top 0.229: C14.1 18.38,44.86 18.38,44.48 21.43,41.43 R24.1 21.43,41.34 20.67,40.58 20.67,39.05 17.53,35.91 17.53,35.72 FB1.2 17.53,35.62 17.53,35.43 18.76,34.19 18.76,30.29 18.57,30.1 17.53,30.1 17.34,30.29 17.34,31.05 U1.8 17.24,32.5 15.34,34.41 10.69,34.41 9.43,33.15 9.24,33.15 R25.1 9.14,33.05 8.29,32.19 8.29,26.38 8.48,26.19 9.81,26.19 10.57,26.96 10.76,26.96 R28.1
CS
  Bottom 0.152: R8.1 65.82,32.96 65.53,32.96 56.29,23.72 53.63,23.72 47.53,17.62 47.53,15.91 55.91,7.53 U$5.D4~
CS_LLS
  Top 0.152: U3.8 46.1,27.34 46.1,22.86 46.67,22.29 46.67,9.81 43.15,6.29 43.15,5.81 J3.P2
DI_LLS
  Top 0.152: U3.3 43.34,21.53 43.34,7.53 42.01,6.19 J3.P3
DO_LLC
  Top 0.152: R9.1 35.05,27.15 35.05,25.72 37.53,23.24 37.53,5.81 J3.P7
GND  (via drill 0.35)
  Top 0.152: 47.91,4.76 47.91,11.43 J3.SH3 | 47.91,4.76 47.91,3.24 J3.SH2 | 43.05,26.48 42.77,26.77 42.77,27.34 U3.13 42.67,27.43 42.67,28 42.29,28.38 40.77,28.38 v40.48,28.1 | 43.05,26.48 44.29,26.48 44.58,26.77 44.58,27.34 U3.10 | 43.05,22.48 43.72,22.48 43.77,22.43 | 43.05,22.48 42.39,22.48 42.01,22.1 42.01,21.62 U3.1 41.91,21.53 41.91,13.05 38.77,9.91 38.77,5.81 J3.P6 | 43.77,22.43 43.91,22.29 43.91,21.62 U3.4 | U3.7 46.01,21.62 46.01,22.1 45.62,22.48 43.81,22.48 43.77,22.43 | 43.05,22.48 43.05,26.48 | J3.P6 38.67,5.71 38.67,5.33 36.58,3.24 34.2,3.24 J3.SH1 34.1,3.24 34.1,4.57 | 34.1,4.57 34.1,11.43 J3.SH4 | 34.1,4.57 24.29,4.57 J1.1 | 47.91,4.76 39.15,4.76 38.67,5.24 J3.P6 | U4.1 23.15,22.67 22.29,22.67 21.53,21.91 20.86,21.91 U4.7 20.77,21.91 20.29,21.43 20.29,20.77 20.77,20.29 U4.5 20.77,20.19 20.77,17.72 17.24,14.19 16,14.19 15.24,14.95 14.95,14.95 R2.1 14.86,15.05 7.62,15.05 5.52,17.14 5.52,19.91 | 13.76,21.67 13.72,21.72 13.72,24.19 13.76,24.24 | 13.76,21.67 14.48,20.95 14.48,20.67 FB2.2 | 13.76,24.24 16.29,26.77 U1.1 | 5.52,19.91 7.81,19.91 8.67,19.05 11.14,19.05 13.76,21.67 | 5.52,19.91 4,19.91 A1-00.1 | R18.1 13.53,41.34 10.95,41.34 9.14,39.53 A5-11.1 9.05,39.43 7.91,38.29 7.91,26.19 9.81,24.29 13.72,24.29 13.76,24.24 | v30.57,34.1 30.57,31.53 R5.1 | R1.1 26.67,52.96 26.67,45.91 32.48,40.1 32.48,39.15 31.91,38.58 27.34,38.58 26.48,39.43 A3-02.1 | U6.7 22.48,92.58 22.48,89.25 U6.6 22.48,89.15 22.48,83.25 20,80.77 20,78.3 20.19,78.11 22.48,78.11 | 19.14,68.87 19.14,64.29 18.67,63.82 C9.2 18.67,63.72 18.67,60.39 C8.2 18.67,60.29 18.67,56.86 C6.2 18.67,56.77 18.67,53.34 C5.1 18.57,53.24 16.67,51.34 16.67,44.96 C14.2 16.67,44.86 v16.67,43.81
  Top 0.152: 19.14,68.87 19.14,70.2 C10.- 19.14,70.29 19.14,71.44 8.57,82.01 8.57,89.92 P1.1 | 19.14,68.87 22.48,68.87 | 22.48,68.87 27.91,68.87 U$2.A | 22.48,68.87 22.48,78.11 | 22.48,78.11 22.48,79.44 U6.3 22.57,79.53 22.57,79.82 23.53,80.77 24.86,80.77 25.81,79.82 25.81,79.53 U6.5 25.81,79.92 29.81,79.92 33.15,83.25 38.86,83.25 38.96,83.15 38.96,77.34 C1.2 39.05,77.25 39.05,71.34 39.81,70.58 C2.- 39.81,70.48 39.81,64.96 38.62,63.77 | 38.34,63.48 39.72,62.1 C17.1 39.81,62.01 39.81,58.58 C3.2 39.81,58.48 39.81,55.05 C16.1 39.81,54.96 39.81,51.82 43.34,48.29 43.34,42.1 IC1.13 43.43,42.01 43.43,41.53 44.2,40.77 54.58,40.77 64.96,30.39 U$5.GND | 38.34,63.48 38.29,63.53 31.81,63.53 3V3.1 | 38.34,63.48 38.62,63.77 | 38.62,63.77 v38.48,63.91
  Bottom 0.152: 16.67,39.53 26.38,39.53 A3-02.1 26.48,39.43 26.48,38.2 v30.57,34.1 30.57,34.2 31.05,34.67 33.91,34.67 v40.48,28.1 | 16.67,39.53 9.14,39.53 A5-11.1 | v38.48,63.91 29.05,63.91 BT1.N1 | v16.67,43.81 16.67,39.53
  pour Top: 0,95 44,95 44,49 48,45 81,45 81,0 0,0
  pour Bottom: 0,95 44,95 44,49 48,45 81,45 81,0 0,0
  cutout Top: 0,52.5 15,52.5 16.5,51 40,51 41,51 42.5,51 44,52.5 44,50.5 16.5,50.5 15,52 0,52
  cutout Bottom: 0,52.5 15,52.5 16.5,51 42.5,51 44,52.5 44,50.5 16.5,50.5 15,52 0,52
MISO
  Top 0.152: U$5.CIPO 70.2,21.24 56.2,21.24 49.05,28.38 44.39,28.38 44.01,28 U3.11
MOSI
  Bottom 0.152: R6.1 48.39,16.95 52.86,16.95 56.2,13.62 76.68,13.62 77.25,13.05 77.25,10.95 76.39,10.1 U$5.COPI
N$1
  Top 0.152: D3.C 60.48,59.63 R12.2
N$3  (via drill 0.35)
  Top 0.152: v42.67,20.29 42.67,21.53 U3.2
  Bottom 0.152: v42.67,20.29 45.91,17.05 46.58,17.05 R6.2
N$4
  Bottom 1.016: P1.2 2,88.54 2,72.63 S1.2
N$5
  Bottom 1.016: S1.1 13.7,83.05 D2.A
N$6  (via drill 0.35)
  Top 0.152: v44.67,17.34 44.67,21.53 U3.5
  Bottom 0.152: v44.67,17.34 55.44,6.57 63.72,6.57 R7.2
N$7  (via drill 0.35)
  Top 0.152: v45.43,26.19 45.43,27.24 45.34,27.34 U3.9
  Bottom 0.152: v45.43,26.19 45.53,26.29 55.82,26.29 62.48,32.96 64.1,32.96 R8.2
N$8
  Top 0.152: R9.2 35.05,28.77 42.58,28.77 43.34,28 43.34,27.43 U3.12
N$9
  Top 0.508: U6.2 20.8,80.8 22,82 26.55,82 U$1.P$1
N$10  (via drill 0.35)
  Top 0.229: v42.01,48.67 42.01,42.1 IC1.14
  Bottom 0.229: 42.01,54.77 42.01,62.39 40.48,63.91 BT1.P1 | 42.01,54.77 v42.01,48.67 | 42.01,54.77 25.24,54.77 17.62,62.39 17.62,63.91 BT1.P2
N$13
  Top 1.016: D2.C 16,90.64 16,82.56 U6.1 19.1,74 C10.+
N$14
  Top 0.508: R1.2 D1.C
P1-A0
  Top 0.305: 14,17.43 16.38,15.05 16.57,15.05 R2.2 | 14,17.43 6.57,17.43 A1-00.2 | 14,17.43 17.81,21.24 17.81,26.77 U1.4
P1-A1
  Top 0.305: 25.05,27.53 24.29,26.77 18.38,26.77 U1.5 | 25.05,27.53 28.96,31.43 R5.2 | 25.05,27.53 24.29,28.29 23.91,28.29 21.72,30.48 21.72,32.1 26.48,36.86 28.96,36.86 A3-02.2
P1-A2
  Top 0.305: U1.6 18.29,31.24 18.29,33 13.62,37.67 13.62,39.62 R18.2 13.72,39.72 14.48,40.48 14.48,42.01 14.19,42.29 13.05,42.29 A5-11.2
P2-A0
  Top 0.305: A2-00.2 73.44,61.53 73.44,63.34 71.44,65.34 66.29,65.34 R4.2 66.2,65.53 62.29,69.44 62.29,75.53 U5.7
P2-A1
  Top 0.305: A4-02.2 73.44,84.01 73.34,84.11 67.06,84.11 R3.2 66.86,84.11 64.86,84.11 61.72,80.96 61.72,79.92 U5.5
P2-A2
  Top 0.305: A6-11.2 54.01,84.01 54.1,84.11 60.48,84.11 R19.2 60.58,84.01 60.58,79.72 61.72,78.58 61.72,75.63 U5.6
P2_3V3  (via drill 0.35)
  Top 0.152: v56.29,68.67 60.39,72.77 C19.2 | 72.87,74.58 73.15,74.58 73.63,74.11 | 72.87,74.58 72.48,74.58 72.3,74.39 72.3,74.3 72.1,74.11 U2.8 | 72.87,74.58 72.87,76.39 U2.2 72.87,76.49 72.87,77.82 73.2,78.15 | 73.63,74.11 74.39,74.11 U2.5 74.49,74.01 74.49,73.44 78.49,69.44 78.49,69.15 R13.2 78.49,69.06 78.49,65.15 67.53,54.2 67.53,53.05 J2.4 | 73.63,74.11 U2.6 | 73.2,78.15 75.82,80.77 78.49,80.77 R30.2 | 73.2,78.15 v72.39,78.96
  Bottom 0.152: R22.2 54.2,67.53 55.34,68.67 v56.29,68.67 56.82,69.2 | 56.82,69.2 56.86,69.25 62.39,69.25 67.91,74.77 67.91,75.15 U$4.5 | 71.87,79.49 69.91,77.53 68.39,77.53 68.34,77.49 | 71.87,79.49 72.68,80.3 72.96,80.3 C18.2 | 68.34,77.49 68.01,77.15 68.01,76.87 U$4.2 | 68.34,77.49 67.15,78.68 67.15,80.96 R23.2 67.06,80.96 57.91,80.96 55.72,78.77 55.72,74.96 56.77,73.91 56.77,69.25 56.82,69.2 | v72.39,78.96 71.87,79.49
P2_5V
  Top 0.152: FB3.1 60.29,66.1 58.29,66.1 54.2,62.01 R20.2 54.1,61.91 53.63,61.44 50.01,61.44 D3.A 49.91,61.44 48.67,62.67 48.67,65.91 C24.1 48.67,66.01 49.44,66.77 50.01,66.77 53.63,70.39 53.63,70.96 C23.1 53.63,71.06 53.63,71.53 50.2,74.96 C22.1 50.2,75.06 50.2,78.96 C20.1 50.2,79.06 50.2,82.01 55.58,87.39 | A2-00.4 73.53,66.48 76.01,64.01 A2-00.3 | A4-02.4 73.53,88.96 76.01,86.49 A4-02.3 | 55.58,87.39 56.48,86.49 A6-11.3 | 55.58,87.39 54.01,88.96 A6-11.4
  Bottom 0.152: J2.5 72.58,53.05 72.58,59.24 76.01,62.67 76.01,63.91 A2-00.3 | 58.44,84.63 56.58,86.49 A6-11.3 | 58.44,84.63 58.48,84.58 58.48,81.92 R21.2 | 58.44,84.63 62.77,88.96 73.44,88.96 A4-02.4 | A2-00.4 73.53,66.58 73.53,69.25 76.01,71.72 76.01,86.49 A4-02.3
P2_ADC_GND  (via drill 0.35)
  Top 0.229: v63.44,81.63 63.44,81.34 62.77,80.68 62.77,79.92 U5.3
  Bottom 0.229: v63.44,81.63 63.44,83.06 FB4.1
P2_ADC_PWR  (via drill 0.35)
  Top 0.229: v60.29,70.67 60.29,67.91 FB3.2 | U5.1 63.72,79.82 63.72,78.68 62.77,77.72 62.77,75.63 U5.8 62.77,75.53 62.77,72.1 63.1,71.77 | v69.06,70.01 67.63,70.01 67.53,70.1 R26.2 67.44,70.2 64.58,70.2 R27.2 64.58,70.29 63.1,71.77 | v63.06,71.72 63.1,71.77
  Bottom 0.229: 60.29,71.72 60.29,71.91 56.58,75.63 R29.2 | 60.29,71.72 v60.29,70.67 | v69.06,70.01 71.06,70.01 C7.2 | v63.06,71.72 60.29,71.72
P2_GND
  Top 0.152: 61.72,61.44 64.01,61.44 66.2,63.63 R4.1 66.29,63.72 66.48,63.91 70.87,63.91 A2-00.1 | 61.72,61.44 61.15,61.44 | 61.15,61.44 60.58,61.44 R12.1 | 61.72,61.44 61.72,55.53 58.01,51.82 57.05,51.82 55.91,52.96 52.58,52.96 J2.1 | 55.63,71.25 55.44,71.06 C23.2 | 55.63,71.25 57.15,72.77 58.86,72.77 C19.1 | 54.15,69.77 55.34,70.96 C23.2 | 54.15,69.77 50.39,66.01 C24.2 | 55.63,71.25 51.91,74.96 C22.2 51.91,75.06 51.91,78.96 C20.2 51.91,79.06 51.91,83.15 54.29,85.53 56.96,85.53 58.91,87.49 | 55.63,71.25 C23.2 | 58.91,87.49 60.48,85.92 R19.1 60.58,85.82 66.96,85.82 R3.1 67.06,85.92 70.29,85.92 70.87,86.49 A4-02.1 70.96,86.49 72.3,86.49 74.39,84.39 74.39,83.53 71.72,80.87 71.72,78.68 72.01,78.39 72.01,76.49 U2.1 72.01,76.39 71.53,75.91 71.53,73.72 71.72,73.53 72.3,73.53 72.77,74.01 U2.7 | 58.91,87.49 56.39,90.01 53.63,90.01 51.53,87.92 51.53,86.58 A6-11.1 | 61.15,61.44 61.15,66.77 60.87,67.06 56.86,67.06 54.15,69.77
  Bottom 0.152: C7.1 72.77,69.91 72.77,67.15 70.96,65.34 A2-00.1 | 66.91,82.63 64.77,84.77 63.53,84.77 FB4.2 | 66.91,82.63 68.01,81.53 68.01,80.39 68.2,80.2 69.44,80.2 69.53,80.3 71.44,80.3 C18.1 | 66.91,82.63 70.87,86.58 A4-02.1
  pour Bottom: 46,95 46,50 49,47 81,47 81,95
  pour Top: 46,95 46,50 49,47 81,47 81,95
P2_SCL  (via drill 0.35)
  Top 0.229: v68.39,72.77 67.53,71.91 R26.1 67.44,71.91 63.82,75.53 U5.10 | R20.1 55.91,61.91 58.48,61.91 59.91,60.48 61.15,60.48 61.34,60.29 61.34,56.86 57.53,53.05 J2.2
  Bottom 0.229: U$4.4 68.58,75.15 68.58,72.96 v68.39,72.77 68.39,71.82 57.53,60.96 57.53,53.05 J2.2
P2_SCL_3V  (via drill 0.35)
  Top 0.229: R30.1 78.49,79.06 75.91,76.49 74.49,76.49 U2.4 74.49,76.58 v73.53,77.53
  Bottom 0.229: 72.72,78.34 73.82,79.44 73.82,80.87 73.53,81.15 68.96,81.15 68.87,81.06 R23.1 | 72.72,78.34 71.25,76.87 68.67,76.87 U$4.3 | 72.72,78.34 v73.53,77.53
P2_SDA  (via drill 0.35)
  Top 0.229: R27.1 64.48,71.91 64.48,73.63 63.34,74.77 63.34,75.53 U5.9 63.34,75.63 63.34,76.49 v64.48,77.63
  Bottom 0.229: 64.53,77.68 62.1,80.11 58.58,80.11 R21.1 | 64.53,77.68 65.34,76.87 67.34,76.87 U$4.1 67.44,76.77 67.44,76.3 67.72,76.01 68.87,76.01 69.15,75.72 69.15,72.01 62.58,65.44 62.58,53.05 J2.3 | v64.48,77.63 64.53,77.68
P2_SDA_3V  (via drill 0.35)
  Top 0.229: 73.63,75.72 73.63,76.39 U2.3 | 73.63,75.72 78.49,70.87 R13.1 | 60.44,71.48 60.29,71.34 60.01,71.34 v57.24,68.58 | 60.44,71.48 v61.44,72.48 | v64.39,66.29 64.39,66.67 60.96,70.1 60.96,70.96 60.44,71.48 | v73.63,75.53 73.63,75.72
  Bottom 0.229: v61.44,72.48 64.1,75.15 67.34,75.15 U$4.6 | v57.24,68.58 56.2,67.53 55.91,67.53 R22.1 | v64.39,66.29 v73.63,75.53
RDY1
  Top 0.229: R28.2 9.24,27.05 9.43,27.05 10.29,27.91 16.48,27.91 16.76,27.62 16.76,26.86 U1.2
RDY2  (via drill 0.35)
  Top 0.229: v62.67,78.58 63.25,79.15 63.25,79.82 U5.2
  Bottom 0.229: v62.67,78.58 61.53,77.44 56.58,77.44 R29.1
SCK
  Bottom 0.152: R7.1 66.39,7.53 71.25,7.53 76.3,12.57 U$5.SCK
SCK_LLS  (via drill 0.35)
  Top 0.152: v45.34,12.29 45.34,21.53 U3.6 | v40,8.5 J3.P5
  Bottom 0.152: v45.34,12.29 v40,8.5
SCL
  Top 0.229: 21.43,37.91 21.43,32.48 19.14,30.19 19.14,30.1 18.76,29.72 16.95,29.72 16.38,30.29 16.38,31.15 U1.10 | 21.43,37.91 21.43,39.62 R24.2 | 33.58,32.91 33.72,33.05 33.72,33.34 33.91,33.53 35.15,33.53 | 33.58,32.91 31.24,30.57 31.24,26.86 U$3.4 | 35.15,33.53 39.53,37.91 39.53,42.01 IC1.16 39.62,42.2 39.62,42.77 40.39,43.53 41.24,43.53 41.43,43.34 41.43,40.96 45.43,36.96 55.91,36.96 72.58,20.29 76.3,20.29 U$5.SCL | 35.15,33.53 35.15,33.43 35.34,33.24 35.34,32 33.34,30 33.34,26.86 34.86,25.34 34.86,20.1 34,19.24 R14.1 34,19.05 34,18.67 19.91,4.57 19.34,4.57 J1.2 | 21.43,37.91 29.43,37.91 32.77,34.58 32.77,33.72 33.58,32.91
SCL_3V
  Top 0.229: U4.4 23.24,20.29 26.38,20.29 29.15,17.53 R11.1 28.86,17.91 31.72,20.77 31.72,22.1 31.24,22.57 31.24,25.15 U$3.3 31.24,25.24 31.72,25.72 31.72,28.96 34.48,31.72 34.48,32.58 R17.1
SDA  (via drill 0.35)
  Top 0.229: v29.81,22.57 29.81,25.15 U$3.1 | R15.1 22.1,14.95 22.1,12.38 14.29,4.57 J1.3 | 13.05,33.05 10.86,33.05 R25.2 | 13.05,33.05 18.19,27.91 23.62,27.91 v24,27.53 | 40.77,36.1 40.77,42.01 IC1.15 | 40.77,36.1 34,29.34 v34,28 | U$5.SDA 76.3,17.72 74.3,17.72 57.53,34.48 42.48,34.48 40.86,36.1 40.77,36.1 | U1.9 16.77,31.18 16.77,31.91 15.63,33.05 13.05,33.05
  Bottom 0.229: J1.3 14.29,4.57 29.81,20.1 v29.81,22.57 29.72,22.57 29.15,23.15 | v24,27.53 24.77,27.53 29.15,23.15 | 29.15,23.15 v34,28
SDA_3V
  Top 0.229: U4.3 23.24,21.14 28.86,21.14 29.15,21.43 R10.1 29.15,21.53 29.15,25.53 29.81,26.19 29.81,26.77 U$3.6 29.81,26.86 29.81,32.1 29.62,32.29 28.29,32.29 27.53,31.53 24.38,31.53 R16.1

### Text on the board
tNames: + | - | GND | SCL | SDA | 3V3 | 5V | Built With Love | Tested For Accuracy | 5V_1A | 3V3_1A | SDA | SCL | GND | Fort Lewis College / Methane Flux v2.0